# Altium project BoostConv_Control_Board.PrjPcb
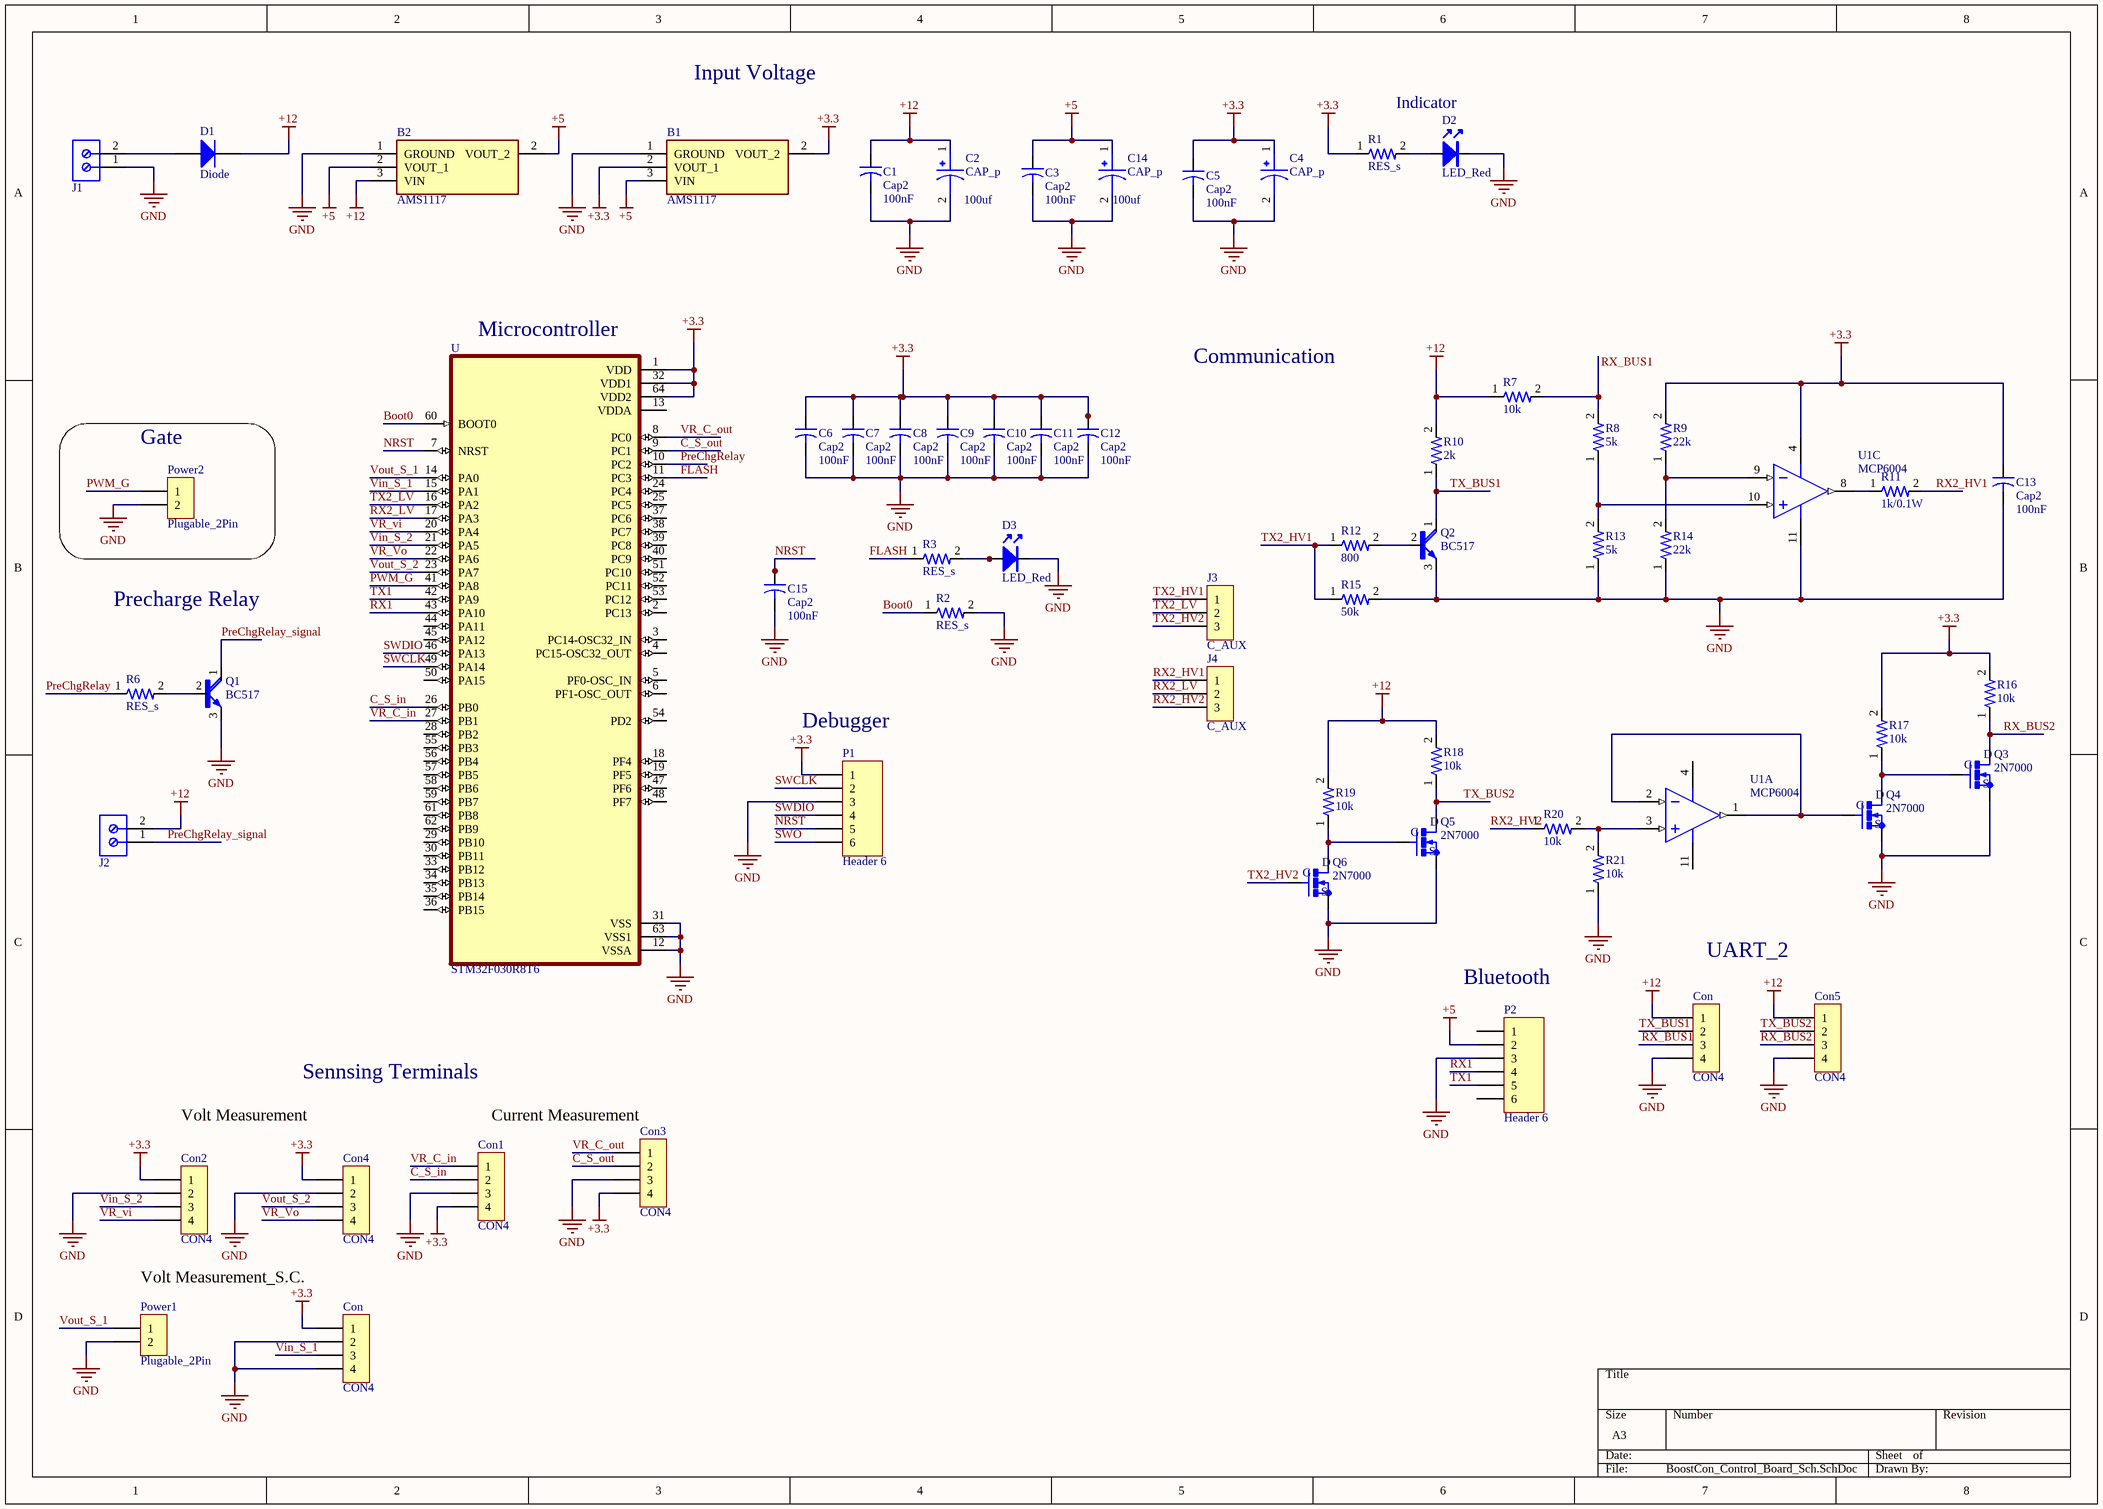
[diagram p0: BoostCon_Control_Board_Sch.SchDoc]
1 sheet, 62 parts. Net scope: global (net labels, ports and power ports of the same name join across sheets).
Board file: BoostCon_Control_Board_PCB.PcbDoc

## Sheet BoostCon_Control_Board_Sch.SchDoc
size A3; SheetNumber: 1; SheetTotal: 1; SPICEModelCacheEONFDCYA: <root> / <DocumentId>EONFDCYA</DocumentId> / <CacheFrame Number="0"> / <Model Name="cap" Kind="MDL"> / <Text>*Default semiconductor capacitor / .MODEL CAP C()</Text> / </Model> / </CacheFrame> / </root>

### Parts
(Parts that share a designator on the sheet are numbered #1, #2 ... from top to bottom, then left to right.)
B1  AMS1117  [78MXX2]
B2  AMS1117  [78MXX2]
C1  Cap2  value 100nF  [CAPR5-4X5]
C2  CAP_p  value 100uf  [CAP-1.5]
C3  Cap2  value 100nF  [CAPR5-4X5]
C4  CAP_p  [CAP-1.5]
C5  Cap2  value 100nF  [CAPR5-4X5]
C6  Cap2  value 100nF  [CAPR5-4X5]
C7  Cap2  value 100nF  [CAPR5-4X5]
C8  Cap2  value 100nF  [CAPR5-4X5]
C9  Cap2  value 100nF  [CAPR5-4X5]
C10  Cap2  value 100nF  [CAPR5-4X5]
C11  Cap2  value 100nF  [CAPR5-4X5]
C12  Cap2  value 100nF  [CAPR5-4X5]
C13  Cap2  value 100nF  [CAPR5-4X5]
C14  CAP_p  value 100uf  [CAP-1.5]
C15  Cap2  value 100nF  [CAPR5-4X5]
Con1  CON4  [SIP4]
Con2  CON4  [SIP4]
Con3  CON4  [SIP4]
Con4  CON4  [SIP4]
Con5  CON4  [TB4]
Con#1  CON4  [TB4]
Con#2  CON4  [SIP4]
D1  Diode  [DO-201AD]
D2  LED_Red  [LED3]
D3  LED_Red  [LED3]
J1  691111710002  [691134710002]  (value not drawn)
J2  691111710002  [691134710002]  (value not drawn)
J3  C_AUX  [SIP3]
J4  C_AUX  [SIP3]
P1  Header 6  [HDR1X6]
P2  Header 6  [HDR1X6]
Power1  Plugable_2Pin  [SIP2]
Power2  Plugable_2Pin  [SIP2]
Q1  BC517  [TO92-bc517]
Q2  BC517  [TO92-bc517]
Q3  2N7000  [TO92]
Q4  2N7000  [TO92]
Q5  2N7000  [TO92]
Q6  2N7000  [TO92]
R1  RES_s  [R3]
R2  RES_s  [R3]
R3  RES_s  [R3]
R6  RES_s  [R3]
R7  10k  [R3]
R8  5k  [R3]
R9  22k  [R3]
R10  2k  [R3]
R11  1k/0.1W  [R3]
R12  800  [R3]
R13  5k  [R3]
R14  22k  [R3]
R15  50k  [R3]
R16  10k  [R3]
R17  10k  [R3]
R18  10k  [R3]
R19  10k  [R3]
R20  10k  [R3]
R21  10k  [R3]
U  STM32F030R8T6  [LQFP64_M - CONVERTER]
U1  MCP6004  [DIP14]  (parts A,C of 4)

### Blocks framed on the sheet
Gate: Power2

### Nets
+3.3: B1.2(VOUT_1) C4.1 C5.1 C6.1 C7.1 C8.1 C9.1 C10.1 C11.1 C12.1 C13.1 Con1.4 Con2.1 Con3.4 Con4.1 Con#2.1 P1.1 R1.1 R9.2 R16.2 R17.2 U.1(VDD) U.32(VDD1) U.64(VDD2) U1.4(VCC)
+5: B1.3(VIN) B2.2(VOUT_1) C3.1 C14.1 P2.2
+12: B2.3(VIN) C1.1 C2.1 Con5.1 Con#1.1 D1.K J2.2 R7.1 R10.2 R18.2 R19.2
GND: B1.1(GROUND) B2.1(GROUND) C1.2 C2.2 C3.2 C4.2 C5.2 C6.2 C7.2 C8.2 C9.2 C10.2 C11.2 C12.2 C13.2 C14.2 C15.2 Con1.3 Con2.2 Con3.3 Con4.2 Con5.4 Con#1.4 Con#2.2 Con#2.4 D2.K D3.K J1.1 P1.3 P2.3 Power1.2 Power2.2 Q1.3(E) Q2.3(E) Q3.3(S) Q4.3(S) Q5.3(S) Q6.3(S) R2.2 R13.1 R14.1 R15.2 R21.1 U.12(VSSA) U.31(VSS) U.63(VSS1) U1.11(VEE)
Boot0: R2.1 U.60(BOOT0)
C_S_in: Con1.2 U.26(PB0)
C_S_out: Con3.2 U.9(PC1)
FLASH: R3.1 U.11(PC3)
NRST: C15.1 P1.5 U.7(NRST)
PreChgRelay: R6.1 U.10(PC2)
PreChgRelay_signal: J2.1 Q1.1(C)
PWM_G: Power2.1 U.41(PA8)
RX1: P2.4 U.43(PA10)
RX2_HV1: J4.1 R11.2
RX2_HV2: J4.3 R20.1
RX2_LV: J4.2 U.17(PA3)
RX_BUS2: Con5.3 Q3.1(D) R16.1
SWCLK: P1.2 U.49(PA14)
SWDIO: P1.4 U.46(PA13)
SWO: P1.6
TX1: P2.5 U.42(PA9)
TX2_HV1: J3.1 R12.1 R15.1
TX2_HV2: J3.3 Q6.2(G)
TX2_LV: J3.2 U.16(PA2)
TX_BUS1: Con#1.2 Q2.1(C) R10.1
TX_BUS2: Con5.2 Q5.1(D) R18.1
Vin_S_1: Con#2.3 U.15(PA1)
Vin_S_2: Con2.3 U.21(PA5)
Vout_S_1: Power1.1 U.14(PA0)
Vout_S_2: Con4.3 U.23(PA7)
VR_C_in: Con1.1 U.27(PB1)
VR_C_out: Con3.1 U.8(PC0)
VR_vi: Con2.4 U.20(PA4)
VR_Vo: Con4.4 U.22(PA6)
RX_BUS1: Con#1.3 R7.2 R8.2
NetD1_A: D1.A J1.2
NetD2_A: D2.A R1.2
NetD3_A: D3.A R3.2
NetQ1_2: Q1.2(B) R6.2
NetQ2_2: Q2.2(B) R12.2
NetQ3_2: Q3.2(G) Q4.1(D) R17.1
NetQ4_2: Q4.2(G) U1.1(1_OUT) U1.2(1_IN-)
NetQ5_2: Q5.2(G) Q6.1(D) R19.1
NetR8_1: R8.1 R13.2 U1.10(3_IN+)
NetR9_1: R9.1 R14.2 U1.9(3_IN-)
NetR11_1: R11.1 U1.8(3_OUT)
NetR20_2: R20.2 R21.2 U1.3(1_IN+)

Not connected (* = marked no-connect by the designer): P2 1 6; U 2(PC13) 3(PC14-OSC32_IN) 4(PC15-OSC32_OUT) 5(PF0-OSC_IN) 6(PF1-OSC_OUT) 13(VDDA) 18(PF4) 19(PF5) 24(PC4) 25(PC5) 28(PB2) 29(PB10) 30(PB11) 33(PB12) 34(PB13) 35(PB14) 36(PB15) 37(PC6) 38(PC7) 39(PC8) 40(PC9) 44(PA11) 45(PA12) 47(PF6) 48(PF7) 50(PA15) 51(PC10) 52(PC11) 53(PC12) 54(PD2) 55(PB3) 56(PB4) 57(PB5) 58(PB6) 59(PB7) 61(PB8) 62(PB9)

### Notes on the sheet
- Input Voltage
- Indicator
- (near U) Microcontroller
- Communication
- Precharge Relay
- (near P1) Debugger
- (near P2) Bluetooth
- UART_2
- Volt Measurement
- Sennsing Terminals
- Current Measurement
- Volt Measurement_S.C.

### Library data of the parts
B1 B2 = AMS1117: 1117; Manufacturer_Name: Advanced Monolithic Systems; Geometry.Height: 1.8mm; Manufacturer_Part_Number: AMS1117; Mouser Part Number: *; Mouser Price/Stock: *; Arrow Part Number: *; Arrow Price/Stock: *; Datasheet Link: https://datasheet.lcsc.com/szlcsc/Advanced-Monolithic-Systems-AMS-AMS1117-ADJ_C6188.pdf
C1 C3 C5-C13 C15 = Cap2: Capacitor; Published: 23-Sep-2002; PackageReference: CAPR5-4X5; Publisher: Altium Limited; PackageDescription: Capacitor; 2 Leads
C2 C14 = CAP-DC
C4 = CAP-DC: Value: 100uf
Con1-Con5 Con#1 Con#2 = CON4: 4Pin_pinHeader; SMD/TH: TH; DPM/VM/AM: DPM, VM, AM
D1 = Diode: SMD/TH: SMD
D2 D3 = LED: Led_Red_1206; SMD/TH: SMD; DPM/VM/AM: DPM, VM, AM
J1 J2 = 691111710002: WR-TBL Series 111 Horizontal Entry Modular, THT, pitch 5mm, 2p; Manufacturer: Wurth Elektronik; Modularity: Yes; Rated Current: 15A; Working Voltage: 250V; ComponentLink1Description: Website Link; ComponentLink1URL: https://www.we-online.com/redexpert/article/691111710002?ad; ComponentLink2Description: Datasheet Link; ComponentLink2URL: https://www.we-online.com/redexpert/spec/691111710002?ad; Manufacturer Part Number: 691111710002; Category: Terminal Blocks; Match Code: WR-TBL; Mount: Through Hole; Operating Temperature Max: 105°C; Operating Temperature Min: -40°C; Packaging: Box; Application: Pressure Clamp; Number of Pins: 2; Number of Rows: 1; Orientation: Horizontal; Pitch: 5mm
J3 J4 = CON3: Connector; note: SC; SMD/TH: TH
P1 P2 = Header 6: Header, 6-Pin; LatestRevisionDate: 17-Jul-2002; LatestRevisionNote: Re-released for DXP Platform.; Publisher: Altium Limited
Power1 Power2 = CON2: Connector; SMD/TH: TH
Q1 Q2 = BC517: Bipolar _BJT_ Transistor NPN - Darlington 30V 1A 200MHz 625mW Through Hole TO-92-3; MF: ON; SnapEDA_Link: https://www.snapeda.com/parts/BC517/ON%20Semiconductor/view-part/703680/?ref=snap; Price: None; Availability: Unavailable; Package: TO-92 NXP Semiconductors; MP: BC517; Value: *
Q3-Q6 = 2N7000: N-Channel 60 V 350mA (Tc) 1W (Tc) Through Hole TO-92-3; MF: STMicroelectronics; SnapEDA_Link: https://www.snapeda.com/parts/2N7000/STMicroelectronics/view-part/?ref=snap; Package: E-PKG AXIAL-LEADED-2 ON Semiconductor; Value: *; MP: 2N7000; Check_prices: https://www.snapeda.com/parts/2N7000/STMicroelectronics/view-part/?ref=eda
R1-R3 R6-R21 = RES
U = STM32F030R8T6: ARMÂ® CortexÂ®-M0 STM32F0 Microcontroller IC 32-Bit 48MHz 64KB _64K x 8_ FLASH; MF: STMicroelectronics; Price: None; Package: LQFP-64 STMicroelectronics; MP: STM32F030R8T6; Value: *; Availability: Unavailable; SnapEDA_Link: https://www.snapeda.com/parts/STM32F030R8T6/STMicroelectronics/view-part/312109/?ref=snap
U1 = MCP6004: Low Power Quad Operational Amplifier; note: SC; SMD/TH: SMD